# Altium project Converter.PrjPcb
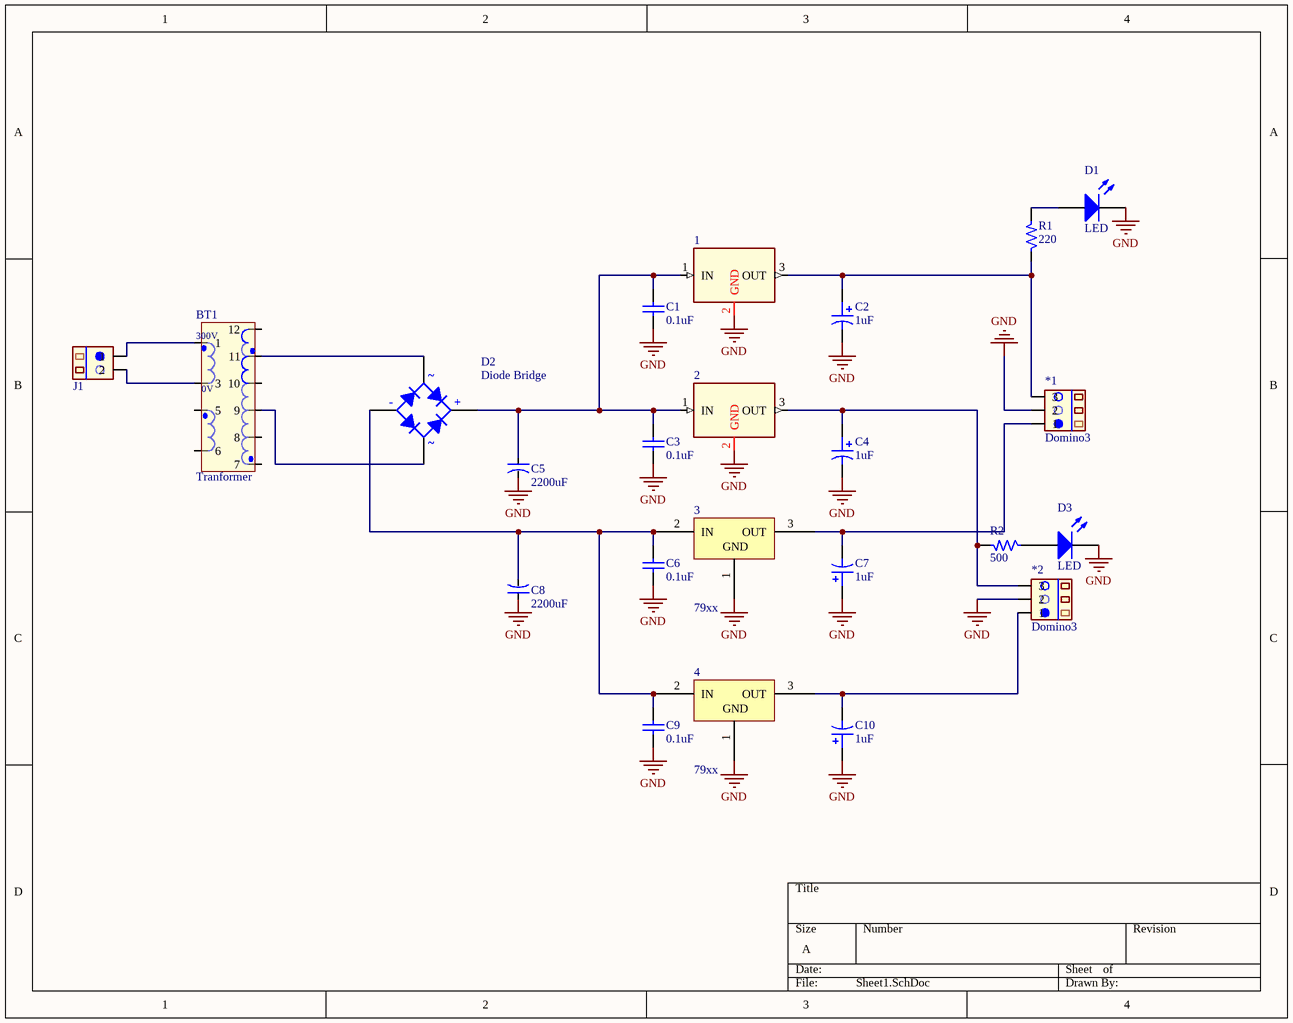
[diagram p0: Sheet1.SchDoc]
1 sheet, 23 parts. Net scope: global (net labels, ports and power ports of the same name join across sheets).
Board file: PCB1.PcbDoc

## Sheet Sheet1.SchDoc
size A

### Parts
1  LM78xx  [TO-220]  (value not drawn)
2  LM78xx  [TO-220]  (value not drawn)
3  79xx  [TO-220-3]
4  79xx  [TO-220-3]
*1  Domino3  [Domino 3N]
*2  Domino3  [Domino 3N]
BT1  Tranformer  [BAX_EE32]
C1  value 0.1uF  [Cap Non-Pol 3mm]  (hidden comment: Cap Non-pol)
C2  value 1uF  [RADIAL C]  (hidden comment: Cap Pol)
C3  value 0.1uF  [Cap Non-Pol 3mm]  (hidden comment: Cap Non-pol)
C4  value 1uF  [RADIAL C]  (hidden comment: Cap Pol)
C5  2200uF  [RADIAL H(2200u_50V)]
C6  value 0.1uF  [Cap Non-Pol 3mm]  (hidden comment: Cap Non-pol)
C7  value 1uF  [RADIAL C]  (hidden comment: Cap Pol)
C8  2200uF  [RADIAL H(2200u_50V)]
C9  value 0.1uF  [Cap Non-Pol 3mm]  (hidden comment: Cap Non-pol)
C10  value 1uF  [RADIAL C]  (hidden comment: Cap Pol)
D1  LED  [LED-0 5mm BLUE]
D2  Diode Bridge  [DIODE BRIDGE (1A)]
D3  LED  [LED-0 5mm RED]
J1  CON.Domino2  [Domino 2M]  (value not drawn)
R1  220  [R1/4W]
R2  500  [R1/4W]

### Nets
GND: 1.2(GND) 2.2(GND) 3.1(GND) 4.1(GND) *1.2 *2.2 C1.1 C2.2 C3.1 C4.2 C5.2 C6.1 C7.1 C8.1 C9.1 C10.1 D1.2(K) D3.2(K)
Net1_1: 1.1(IN) 2.1(IN) C1.2 C3.2 C5.1 D2.1(K)
Net1_3: 1.3(OUT) *1.3 C2.1 R1.1
Net2_3: 2.3(OUT) *2.3 C4.1 R2.2
Net3_2: 3.2(IN) 4.2(IN) C6.2 C8.2 C9.2 D2.4(A)
Net3_3: 3.3(OUT) *1.1 C7.2
Net4_3: 4.3(OUT) *2.1 C10.2
NetBT1_1: BT1.1 J1.1
NetBT1_3: BT1.3 J1.2
NetBT1_9: BT1.9 D2.3(C)
NetBT1_11: BT1.11 D2.2(C)
NetD1_1: D1.1(A) R1.2
NetD3_1: D3.1(A) R2.1

Not connected (* = marked no-connect by the designer): BT1 5 6 7 8 10 12

### Notes on the sheet
- (in symbol BAX_EE32) 300V; 0V
- (in symbol Diode Bridge) ~; -; +

### Library data of the parts
1 2 = LM78xx: Regulator; Manufacturer: Fairchild Semiconductor Corporation; PSpiceTemplate: X^@REFDES %IN %OUT %GND @MODEL; Vendor: Digikey; Output Current: Up to 1A; V out: 5V; Tolerance: 4 %; Value: LM7805CT; Published: 13-April-2009; Publisher: Hoang Nguyen; ComponentLink1Description: Digikey Part Link; ComponentLink2Description: Open Datasheet; ComponentLink2URL: H:\LIBRARY\LIBRARY.Datasheet\LM7805.pdf; Price: 2500 VND
3 4 = 79xx: 3-Terminal 1A Negative Voltage Regulator
BT1 = BAX_EE32: Value: BA xung
C1 C3 C6 C9 = Cap Non-pol: Non-polarized Capacitor; Published: 8-Jun-2000; LatestRevisionDate: 17-Jul-2002; LatestRevisionNote: Re-released for DXP Platform.; PackageReference: RAD-0.3; Publisher: Altium Limited
C2 C4 C7 C10 = Cap Pol: Polarized Capacitor; Published: 8-Jun-2000; LatestRevisionDate: 17-Jul-2002; LatestRevisionNote: Re-released for DXP Platform.; PackageReference: POLAR0.8; Publisher: Altium Limited
C5 C8 = CN-ALU-DIP: Capacitor (Semiconductor SIM Model); Value: 104; LatestRevisionDate: 17-Jul-2002; LatestRevisionNote: Re-released for DXP Platform.; PackageReference: C1206; Publisher: Altium Limited
D1 D3 = LED: Typical LED; Published: 8-Jun-2000; LatestRevisionDate: 08-Jul-2005; LatestRevisionNote: Mech Layer 1 removed.; PackageReference: LED-1; Publisher: Altium Limited
D2 = Diode Bridge: Full Wave Diode Bridge; Published: 8-Jun-2000; LatestRevisionDate: 17-Jul-2002; LatestRevisionNote: Re-released for DXP Platform.; PackageReference: D-38; Publisher: Altium Limited
J1 = CON.Domino2: 2 pins Domino Header; Publisher: Hoang Nguyen; ComponentLink1Description: Digikey Part link; ComponentLink2Description: Open DataSheet; ComponentLink2URL: H:\LIBRARY\LIBRARY.Datasheet\; Price: 2000VND
R1 = R: Resistor 1/4W; Value: R1/4W - 220
R2 = R: Resistor 1/4W; Value: R1/4W - 1K